# Altium schematic sheet Mcu.SchDoc
size A4
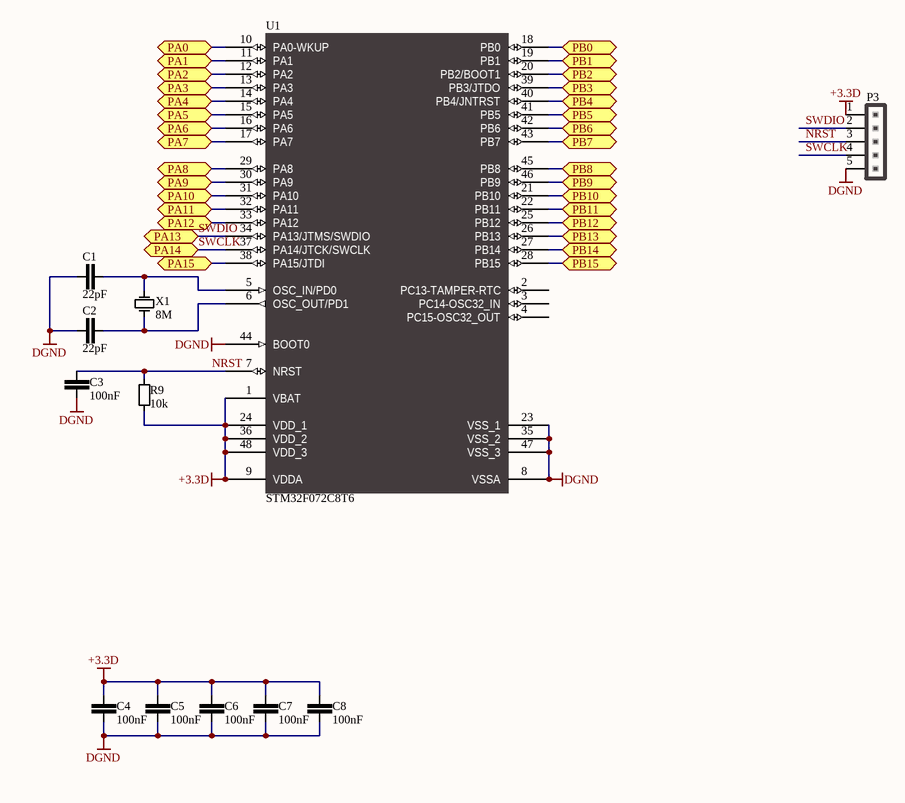
[diagram p0: Mcu.SchDoc]

## Parts
C1  value 22pF  [0603-C]  (hidden comment: Cap)
C2  value 22pF  [0603-C]  (hidden comment: Cap)
C3  value 100nF  [0603-C]  (hidden comment: Cap)
C4  value 100nF  [0603-C]  (hidden comment: Cap)
C5  value 100nF  [0603-C]  (hidden comment: Cap)
C6  value 100nF  [0603-C]  (hidden comment: Cap)
C7  value 100nF  [0603-C]  (hidden comment: Cap)
C8  value 100nF  [0603-C]  (hidden comment: Cap)
P3  Header 5  [HDR-1X5]  (value not drawn)
R9  value 10k  [0603-R]  (hidden comment: Res)
U1  STM32F072C8T6  [LQFP48_N]
X1  value 8M  [5032]  (hidden comment: Crystal)

## Ports
PA0, PA1, PA2, PA3, PA4, PA5, PA6, PA7, PA8, PA9, PA10, PA11, PA12, PA13, PA14, PA15, PB0, PB1, PB2, PB3, PB4, PB5, PB6, PB7, PB8, PB9, PB10, PB11, PB12, PB13, PB14, PB15

## Nets
+3.3D: C4.1 C5.1 C6.1 C7.1 C8.1 P3.1 R9.2 U1.1(VBAT) U1.9(VDDA) U1.24(VDD_1) U1.36(VDD_2) U1.48(VDD_3)
DGND: C1.1 C2.1 C3.1 C4.2 C5.2 C6.2 C7.2 C8.2 P3.5 U1.8(VSSA) U1.23(VSS_1) U1.35(VSS_2) U1.44(BOOT0) U1.47(VSS_3)
NRST: C3.2 P3.3 R9.1 U1.7(NRST)
PA0: U1.10(PA0-WKUP) ; port PA0
PA1: U1.11(PA1) ; port PA1
PA2: U1.12(PA2) ; port PA2
PA3: U1.13(PA3) ; port PA3
PA4: U1.14(PA4) ; port PA4
PA5: U1.15(PA5) ; port PA5
PA6: U1.16(PA6) ; port PA6
PA7: U1.17(PA7) ; port PA7
PA8: U1.29(PA8) ; port PA8
PA9: U1.30(PA9) ; port PA9
PA10: U1.31(PA10) ; port PA10
PA11: U1.32(PA11) ; port PA11
PA12: U1.33(PA12) ; port PA12
PA15: U1.38(PA15/JTDI) ; port PA15
PB0: U1.18(PB0) ; port PB0
PB1: U1.19(PB1) ; port PB1
PB2: U1.20(PB2/BOOT1) ; port PB2
PB3: U1.39(PB3/JTDO) ; port PB3
PB4: U1.40(PB4/JNTRST) ; port PB4
PB5: U1.41(PB5) ; port PB5
PB6: U1.42(PB6) ; port PB6
PB7: U1.43(PB7) ; port PB7
PB8: U1.45(PB8) ; port PB8
PB9: U1.46(PB9) ; port PB9
PB10: U1.21(PB10) ; port PB10
PB11: U1.22(PB11) ; port PB11
PB12: U1.25(PB12) ; port PB12
PB13: U1.26(PB13) ; port PB13
PB14: U1.27(PB14) ; port PB14
PB15: U1.28(PB15) ; port PB15
SWCLK: P3.4 U1.37(PA14/JTCK/SWCLK) ; port PA14
SWDIO: P3.2 U1.34(PA13/JTMS/SWDIO) ; port PA13
NetC1_2: C1.2 U1.5(OSC_IN/PD0) X1.2(OSC2)
NetC2_2: C2.2 U1.6(OSC_OUT/PD1) X1.1(OSC1)

Not connected (* = marked no-connect by the designer): U1 2(PC13-TAMPER-RTC) 3(PC14-OSC32_IN) 4(PC15-OSC32_OUT)

## Library data of the parts
C1 C2 = C11C022PJ1H0: MLCC 22pF 5% 50V NPO 0603; TemperatureRange: -55°C to 150°C; VenderID: MLCC-0603-50V-220J-NPO; Published: 1-Jun-2017; Publisher: GreenBox; MountType: SMT; PackageReference: 0603; Manufacturer: *
C3-C8 = C21C100NK1H0: MLCC 100nF 10% 50V X7R 0603; TemperatureRange: -55°C to 150°C; VenderID: MLCC-0603-50V-104K-X7R; Published: 1-Jun-2017; Publisher: GreenBox; MountType: SMT; PackageReference: 0603; Manufacturer: *
P3 = P1D105Z254D0: Header 5-Pin Pitch 2.54mm Height 11mm; VenderID: 单排针2.54mm针长11mm; Publisher: GreenBox; Published: 1-Jun-2017; MountType: DIP; PackageReference: HDR5X1; TemperatureRange: *; Manufacturer: *
R9 = R11c010KFBF0: SMD Resistor 10k 1% 1/10W 0603 100PPM; TemperatureRange: -55°C to 150°C; VenderID: RES-0603-10k-1%; Published: 1-Jun-2017; Publisher: GreenBox; MountType: SMT; PackageReference: 0603; Manufacturer: *
U1 = UML3072C8T6S: ARM CORTEXM3 STM32F072C8T6; Manufacturer: ST; TemperatureRange: -40 to 85°C; Published: 1-Jun-2017; PackageReference: LQFP48; Publisher: GreenBox; PackageDescription: Thin QFP, 48-Leads, Body 7x7mm, Pitch 0.5mm; MountType: SMT; VenderID: STM32F072C8T6
X1 = XC23000008M1: Crystal 8M 5032 50PPM; Manufacturer: NDK; VenderID: NX5032GA-8.000M-STD-CSU-1; TemperatureRange: -40 to 150°C; PackageReference: 5032; Publisher: GreenBox; Published: 1-Jun-2017; MountType: SMT; PackageDescription: 5032; Body 5.0 x 3.2 x 1.2 mm